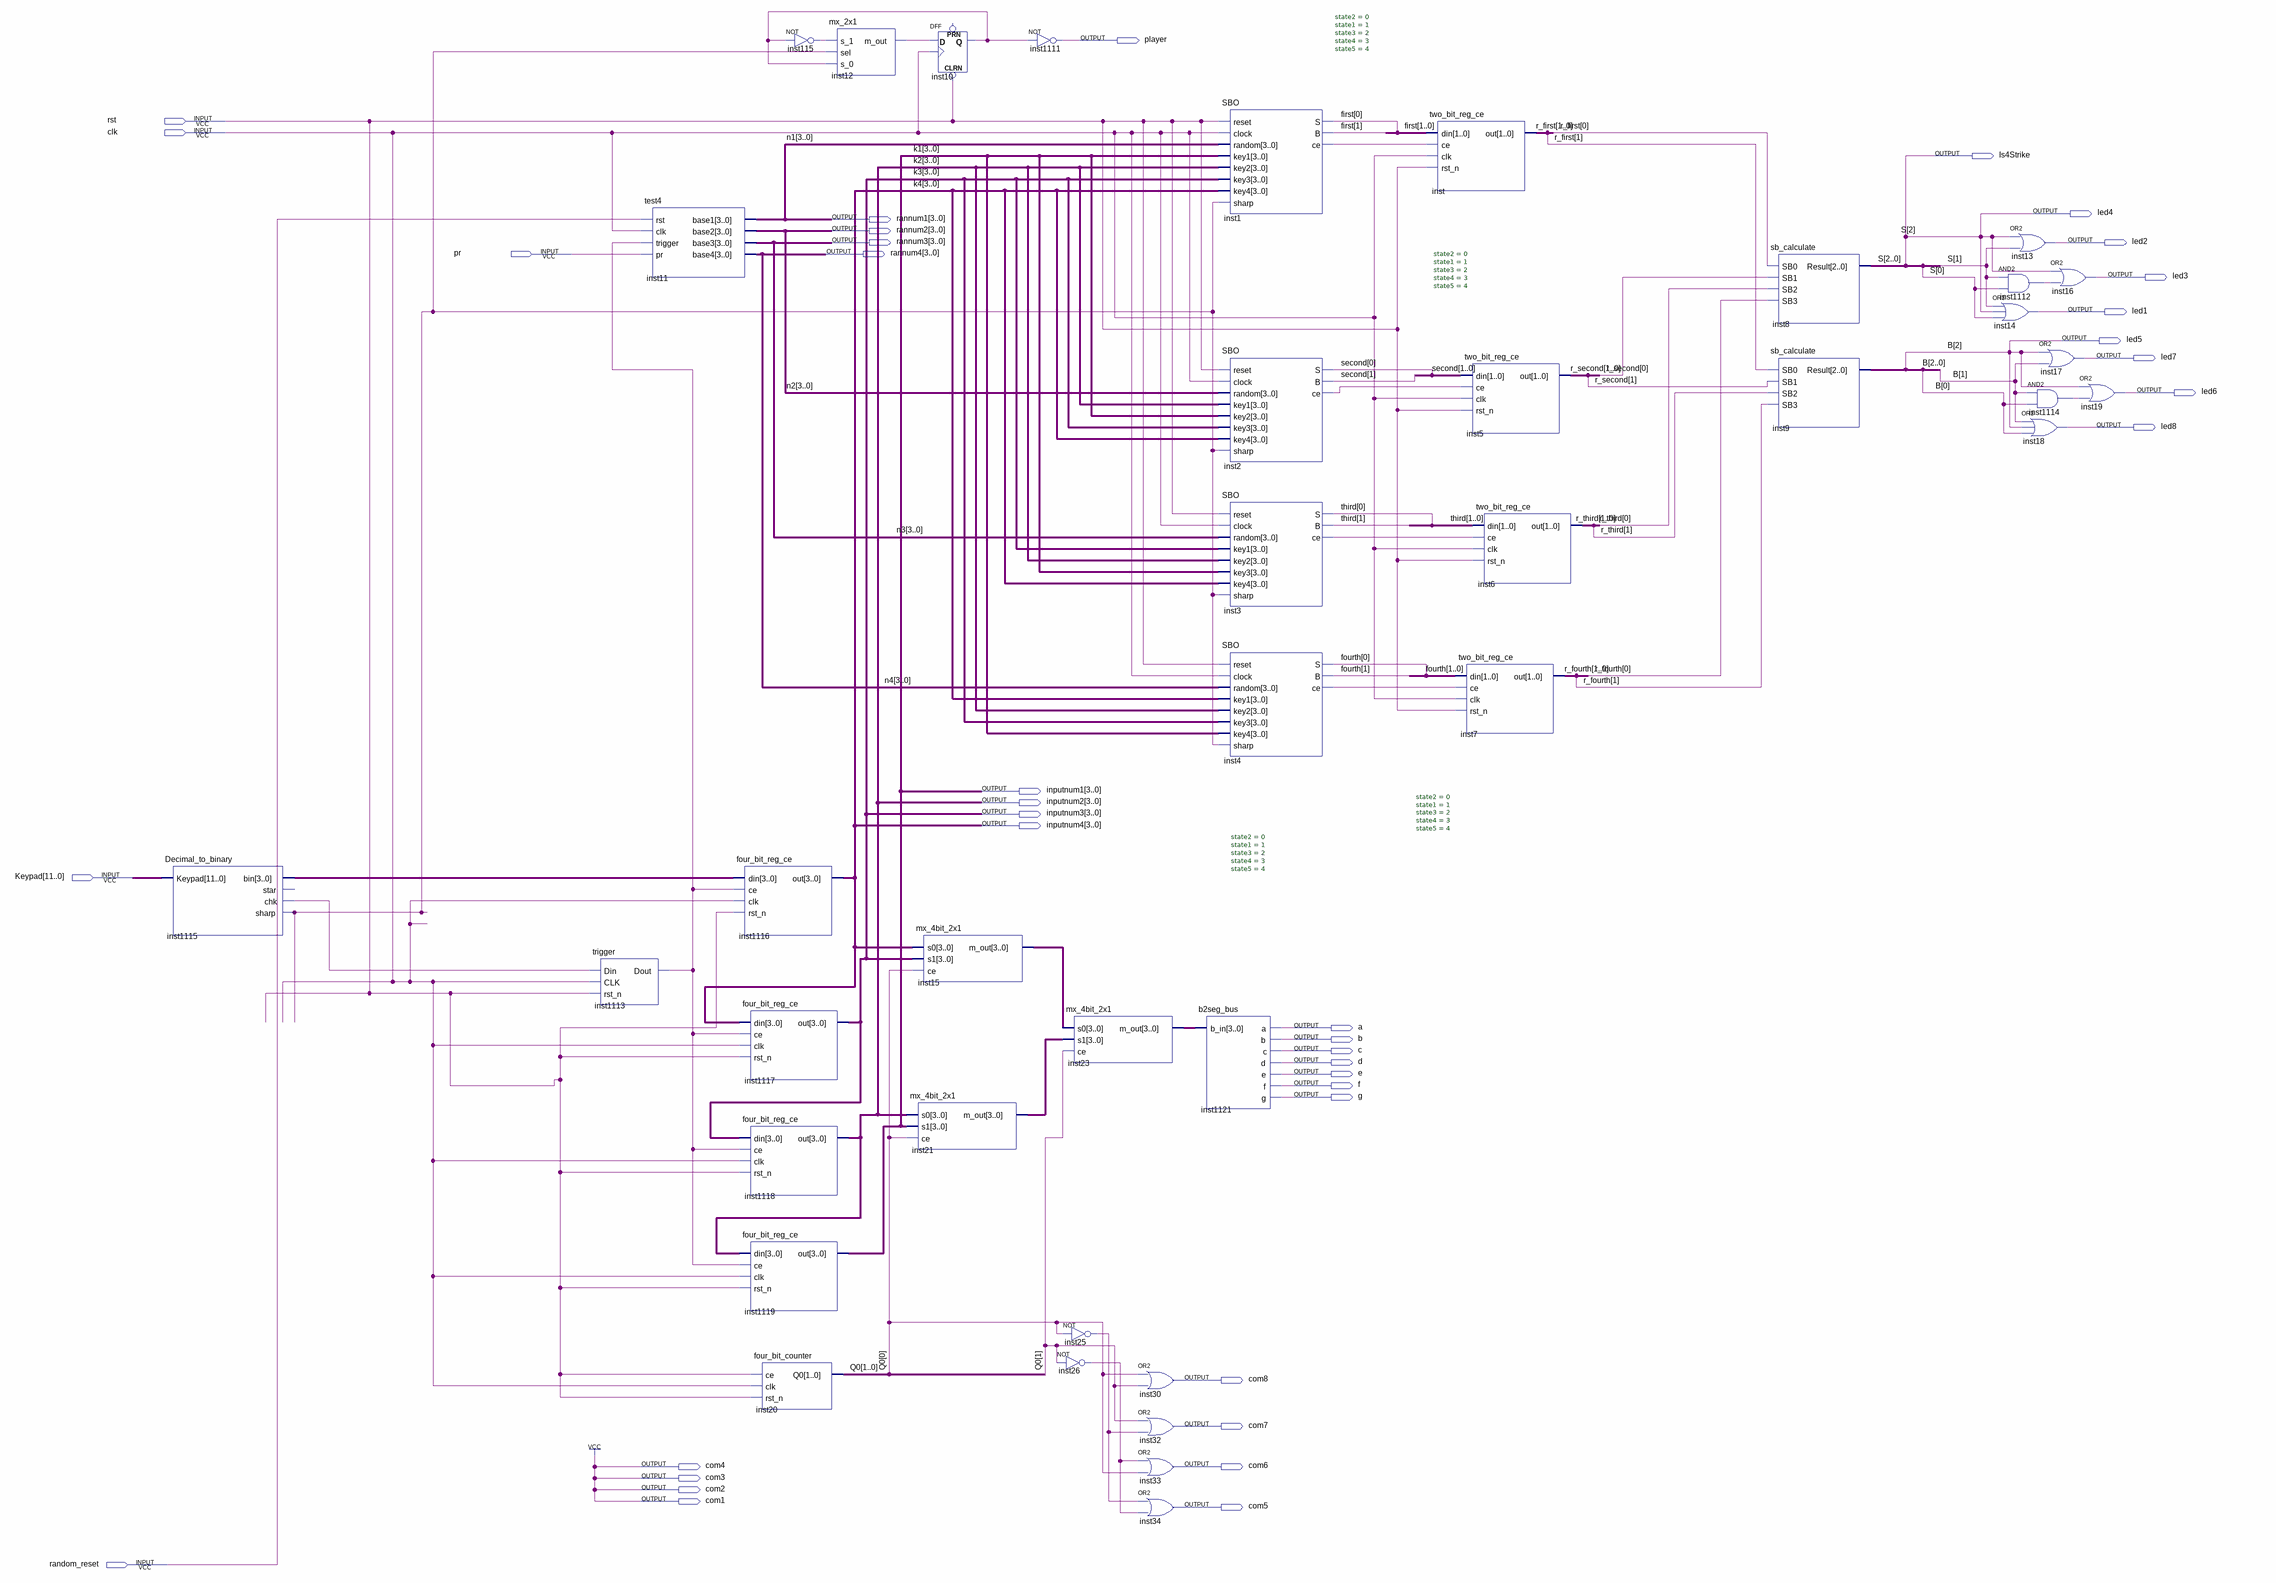
[diagram p0: schematic sheet]
// Quartus schematic test5.bdf as structural Verilog: 40 symbols, 38 pins
module test5 (
  input  rst,
  input  clk,
  input  pr,
  input  [11:0] Keypad,
  input  random_reset,
  output player,
  output Is4Strike,
  output led4,
  output [3:0] rannum1,
  output [3:0] rannum2,
  output [3:0] rannum3,
  output led2,
  output [3:0] rannum4,
  output led3,
  output led1,
  output led5,
  output led7,
  output led6,
  output led8,
  output [3:0] inputnum1,
  output [3:0] inputnum2,
  output [3:0] inputnum3,
  output [3:0] inputnum4,
  output a,
  output b,
  output c,
  output d,
  output e,
  output f,
  output g,
  output com8,
  output com7,
  output com4,
  output com6,
  output com3,
  output com2,
  output com1,
  output com5
);

  wire inst1_ce, inst2_ce, inst3_ce, inst4_ce, inst10_q, inst12_m_out, inst25_out, inst26_out, inst115_out,
       inst1112_out, inst1113_dout, inst1114_out, inst1115_chk, inst1115_sharp;
  wire [1:0] b_bus, first, fourth, Q0, r_first, r_fourth, r_second, r_third, S, second, third;
  wire [3:0] inst15_m_out, inst21_m_out, inst23_m_out, inst1115_bin;

  Decimal_to_binary inst1115 (
    .Keypad(Keypad), .bin(inst1115_bin), .chk(inst1115_chk), .sharp(inst1115_sharp));  // open: star
  trigger inst1113 (.Din(inst1115_chk), .CLK(clk), .rst_n(rst), .Dout(inst1113_dout));
  test4 inst11 (
    .rst(random_reset), .clk(clk), .trigger(inst1113_dout), .pr(pr), .base1(rannum1), .base2(rannum2),
    .base3(rannum3), .base4(rannum4));
  four_bit_reg_ce inst1116 (.din(inst1115_bin), .ce(inst1113_dout), .clk(clk), .rst_n(rst), .out(inputnum4));
  four_bit_reg_ce inst1117 (.din(inputnum4), .ce(inst1113_dout), .clk(clk), .rst_n(rst), .out(inputnum3));
  four_bit_reg_ce inst1118 (.din(inputnum3), .ce(inst1113_dout), .clk(clk), .rst_n(rst), .out(inputnum2));
  four_bit_reg_ce inst1119 (.din(inputnum2), .ce(inst1113_dout), .clk(clk), .rst_n(rst), .out(inputnum1));
  four_bit_counter inst20 (.ce(rst), .clk(clk), .rst_n(rst), .Q0(Q0));
  mx_2x1 inst12 (.s_1(inst115_out), .sel(inst1115_sharp), .s_0(inst10_q), .m_out(inst12_m_out));
  not inst115 (inst115_out, inst10_q);
  mx_4bit_2x1 inst15 (.s0(inputnum4), .s1(inputnum3), .ce(Q0[0]), .m_out(inst15_m_out));
  mx_4bit_2x1 inst21 (.s0(inputnum2), .s1(inputnum1), .ce(Q0[0]), .m_out(inst21_m_out));
  DFF inst10 (.CLRN(rst), .CLK(clk), .D(inst12_m_out), .Q(inst10_q));  // open: PRN
  not inst1111 (player, inst10_q);
  not inst26 (inst26_out, Q0[1]);
  mx_4bit_2x1 inst23 (.s0(inst15_m_out), .s1(inst21_m_out), .ce(Q0[1]), .m_out(inst23_m_out));
  not inst25 (inst25_out, Q0[0]);
  or inst30 (com8, Q0[0], Q0[1]);
  or inst32 (com7, Q0[1], inst25_out);
  or inst33 (com6, inst26_out, Q0[0]);
  or inst34 (com5, inst25_out, inst26_out);
  b2seg_bus inst1121 (.b_in(inst23_m_out), .a(a), .b(b), .c(c), .d(d), .e(e), .f(f), .g(g));
  SBO #(.state2(0), .state1(1), .state3(2), .state4(3), .state5(4)) inst1 (
    .reset(rst), .clock(clk), .random(rannum1), .key1(inputnum1), .key2(inputnum2), .key3(inputnum3),
    .key4(inputnum4), .sharp(inst1115_sharp), .S(first[0]), .B(first[1]), .ce(inst1_ce));
  SBO #(.state2(0), .state1(1), .state3(2), .state4(3), .state5(4)) inst2 (
    .reset(rst), .clock(clk), .random(rannum2), .key1(inputnum2), .key2(inputnum1), .key3(inputnum3),
    .key4(inputnum4), .sharp(inst1115_sharp), .S(second[0]), .B(second[1]), .ce(inst2_ce));
  SBO #(.state2(0), .state1(1), .state3(2), .state4(3), .state5(4)) inst3 (
    .reset(rst), .clock(clk), .random(rannum3), .key1(inputnum3), .key2(inputnum2), .key3(inputnum1),
    .key4(inputnum4), .sharp(inst1115_sharp), .S(third[0]), .B(third[1]), .ce(inst3_ce));
  SBO #(.state2(0), .state1(1), .state3(2), .state4(3), .state5(4)) inst4 (
    .reset(rst), .clock(clk), .random(rannum4), .key1(inputnum4), .key2(inputnum2), .key3(inputnum3),
    .key4(inputnum1), .sharp(inst1115_sharp), .S(fourth[0]), .B(fourth[1]), .ce(inst4_ce));
  two_bit_reg_ce inst (.din(first), .ce(inst1_ce), .clk(clk), .rst_n(rst), .out(r_first));
  two_bit_reg_ce inst5 (.din(second), .ce(inst2_ce), .clk(clk), .rst_n(rst), .out(r_second));
  two_bit_reg_ce inst6 (.din(third), .ce(inst3_ce), .clk(clk), .rst_n(rst), .out(r_third));
  two_bit_reg_ce inst7 (.din(fourth), .ce(inst4_ce), .clk(clk), .rst_n(rst), .out(r_fourth));
  sb_calculate inst8 (
    .SB0(r_first[0]), .SB1(r_second[0]), .SB2(r_third[0]), .SB3(r_fourth[0]), .Result({Is4Strike, S}));
  sb_calculate inst9 (.SB0(r_first[1]), .SB1(r_second[1]), .SB2(r_third[1]), .SB3(r_fourth[1]), .Result({led5, b_bus}));
  or inst13 (led2, Is4Strike, S[1]);
  and inst1112 (inst1112_out, S[1], S[0]);
  or inst14 (led1, S[1], Is4Strike, S[0]);
  and inst1114 (inst1114_out, b_bus[1], b_bus[0]);
  or inst18 (led8, b_bus[1], led5, b_bus[0]);
  or inst16 (led3, Is4Strike, inst1112_out);
  or inst17 (led7, led5, b_bus[1]);
  or inst19 (led6, led5, inst1114_out);

  assign com1 = 1'b1;
  assign com2 = 1'b1;
  assign com3 = 1'b1;
  assign com4 = 1'b1;
  assign led4 = Is4Strike;

  // Other names for the same wires on the sheet: b[2] = led5; k1[3:0] = inputnum1; k2[3:0] = inputnum2;
  //   k4[3:0] = inputnum4; k3[3:0] = inputnum3; n1[3:0] = rannum1; n2[3:0] = rannum2; n3[3:0] = rannum3;
  //   n4[3:0] = rannum4; S[2] = Is4Strike
endmodule
